# EAGLE design One Square Boy (EAGLE 8.6.1)
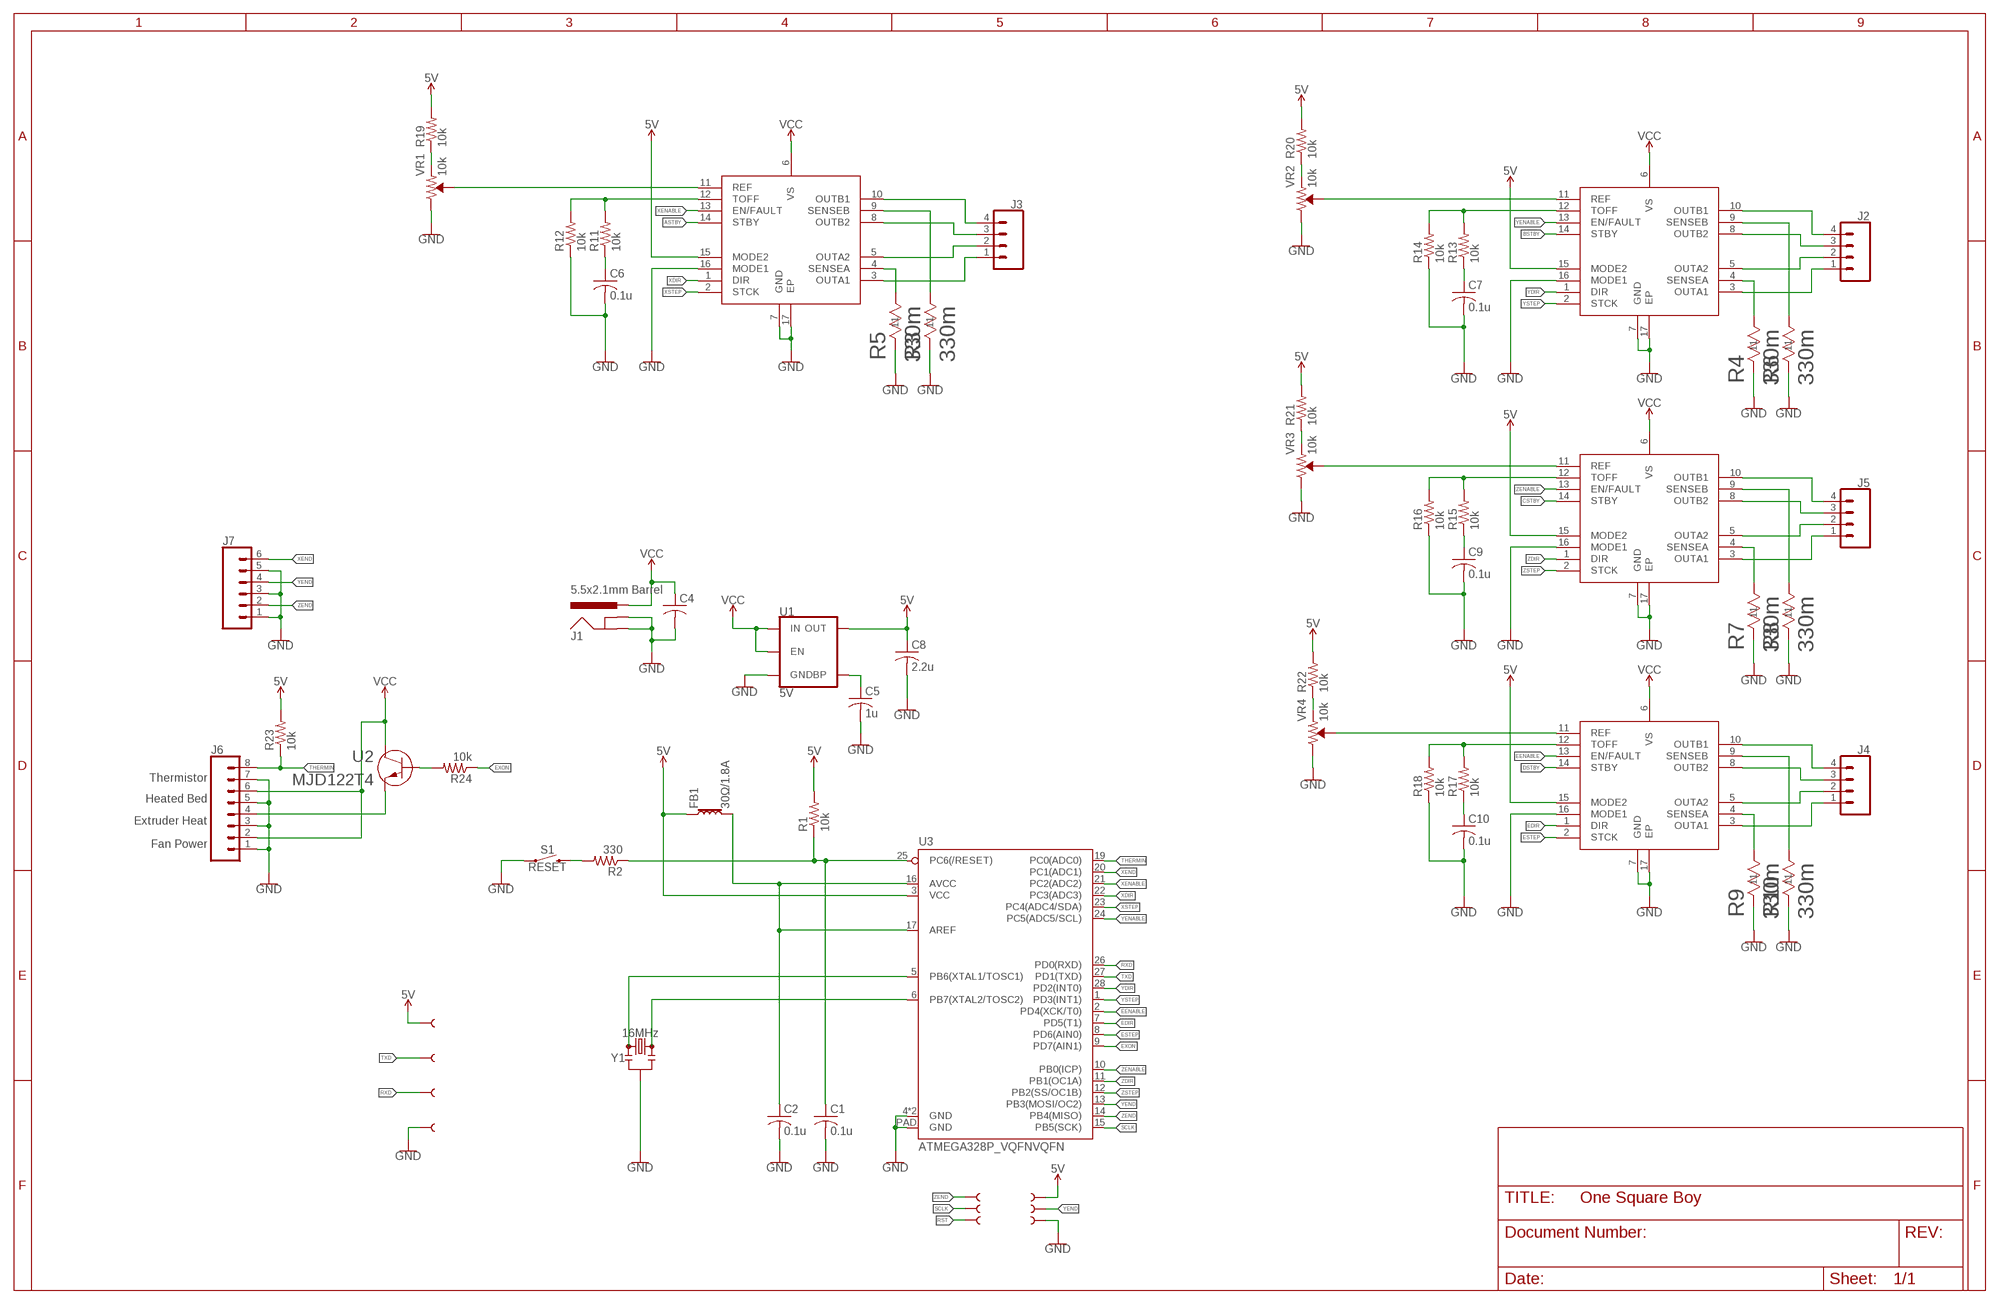
[diagram p0: schematic, sheet 1]

## Parts
C1  0.1u  C-USC0402  [C0402]
C2  0.1u  C-USC0402  [C0402]
C4  C-USC1206  [C1206]
C5  1u  C-USC0402  [C0402]
C6  0.1u  C-USC0402  [C0402]
C7  0.1u  C-USC0402  [C0402]
C8  2.2u  C-USC0402  [C0402]
C9  0.1u  C-USC0402  [C0402]
C10  0.1u  C-USC0402  [C0402]
FB1  30Ω/1.8A  FERRITE_BEAD-0603  [0603]
J1  5.5x2.1mm Barrel  POWER_JACKSMD  [POWER_JACK_SMD]
J2  CONN_04SMD2  [1X04_1MM_RA]
J3  CONN_04SMD2  [1X04_1MM_RA]
J4  CONN_04SMD2  [1X04_1MM_RA]
J5  CONN_04SMD2  [1X04_1MM_RA]
J6  CONN_08BM08B-SRSS-TB  [BM08B-SRSS-TB]
J7  CONN_06SMD-1MM  [1X06-1MM]
R1  10k  R-US_R0402  [R0402]
R2  330  R-US_R0402  [R0402]
R3  330m  KRL2012E-M-R330-F-T5RES_2012-L  [RES_2012-L]
R4  330m  KRL2012E-M-R330-F-T5RES_2012-L  [RES_2012-L]
R5  330m  KRL2012E-M-R330-F-T5RES_2012-L  [RES_2012-L]
R6  330m  KRL2012E-M-R330-F-T5RES_2012-L  [RES_2012-L]
R7  330m  KRL2012E-M-R330-F-T5RES_2012-L  [RES_2012-L]
R8  330m  KRL2012E-M-R330-F-T5RES_2012-L  [RES_2012-L]
R9  330m  KRL2012E-M-R330-F-T5RES_2012-L  [RES_2012-L]
R10  330m  KRL2012E-M-R330-F-T5RES_2012-L  [RES_2012-L]
R11  10k  R-US_R0402  [R0402]
R12  10k  R-US_R0402  [R0402]
R13  10k  R-US_R0402  [R0402]
R14  10k  R-US_R0402  [R0402]
R15  10k  R-US_R0402  [R0402]
R16  10k  R-US_R0402  [R0402]
R17  10k  R-US_R0402  [R0402]
R18  10k  R-US_R0402  [R0402]
R19  10k  R-US_R0402  [R0402]
R20  10k  R-US_R0402  [R0402]
R21  10k  R-US_R0402  [R0402]
R22  10k  R-US_R0402  [R0402]
R23  10k  R-US_R0402  [R0402]
R24  10k  R-US_R0402  [R0402]
S1  RESET  MOMENTARY-SWITCH-SPST-SMD-4.6X2.8MM  [TACTILE_SWITCH_SMD_4.6X2.8MM]
TP1  TEST-POINT3X5  [PAD.03X.05]
TP2  TEST-POINT3X5  [PAD.03X.05]
TP3  TEST-POINT3X5  [PAD.03X.05]
TP4  TEST-POINT3X5  [PAD.03X.05]
TP5  TEST-POINT3X5  [PAD.03X.05]
TP6  TEST-POINT3X5  [PAD.03X.05]
TP7  TEST-POINT3X5  [PAD.03X.05]
TP8  TEST-POINT3X5  [PAD.03X.05]
TP9  TEST-POINT3X5  [PAD.03X.05]
TP10  TEST-POINT3X5  [PAD.03X.05]
U1  5V  V_REG_MIC52055V  [SOT23-5]
U2  MJD122T4  [DPAK]
U3  ATMEGA328P_VQFNVQFN  [VQFN-28]
U$1  STSPIN220  [QFN50P300X300X100-17N]
U$2  STSPIN220  [QFN50P300X300X100-17N]
U$3  STSPIN220  [QFN50P300X300X100-17N]
U$4  STSPIN220  [QFN50P300X300X100-17N]
VR1  10k  TRIMPOT-SMD-3MM-OPEN-1/10W-25%  [TRIMPOT-SMD-TC33X]
VR2  10k  TRIMPOT-SMD-3MM-OPEN-1/10W-25%  [TRIMPOT-SMD-TC33X]
VR3  10k  TRIMPOT-SMD-3MM-OPEN-1/10W-25%  [TRIMPOT-SMD-TC33X]
VR4  10k  TRIMPOT-SMD-3MM-OPEN-1/10W-25%  [TRIMPOT-SMD-TC33X]
Y1  16MHz  RESONATOR-16MHZSMD_3.2X1.3  [RESONATOR-SMD-3.2X1.3]

## Nets
5V: C8.1 FB1.1 R1.2 R19.2 R20.2 R21.2 R22.2 R23.2 TP4.P$1 TP10.P$1 U1.5(OUT) U3.3(VCC) U$1.15(MODE2) U$2.15(MODE2) U$3.15(MODE2) U$4.15(MODE2)
ASTBY: U$1.14(STBY)
AVCC: C2.1 FB1.2 U3.16(AVCC) U3.17(AREF)
BSTBY: U$2.14(STBY)
CSTBY: U$3.14(STBY)
DSTBY: U$4.14(STBY)
EDIR: U3.7(PD5(T1)) U$4.1(DIR)
EENABLE: U3.2(PD4(XCK/T0)) U$4.13(EN/FAULT)
ESTEP: U3.8(PD6(AIN0)) U$4.2(STCK)
EXON: R24.1 U3.9(PD7(AIN1))
GND: C1.2 C2.2 C4.2 C5.2 C6.2 C7.2 C8.2 C9.2 C10.2 J1.GND(GNDBREAK) J1.P$4(GND) J6.1 J6.3 J6.5 J6.7 J7.1 J7.3 J7.5 R3.1 R4.1 R5.1 R6.1 R7.1 R8.1 R9.1 R10.1 R12.1 R14.1 R16.1 R18.1 S1.1 S1.2 TP6.P$1 TP7.P$1 U1.2(GND) U3.4(GND) U3.18(GND) U3.PAD(GND) U$1.7(GND) U$1.16(MODE1) U$1.17(EP) U$2.7(GND) U$2.16(MODE1) U$2.17(EP) U$3.7(GND) U$3.16(MODE1) U$3.17(EP) U$4.7(GND) U$4.16(MODE1) U$4.17(EP) VR1.1(CW) VR2.1(CW) VR3.1(CW) VR4.1(CW) Y1.2
N$1: R2.2 S1.3 S1.4
N$2: U3.5(PB6(XTAL1/TOSC1)) Y1.1
N$3: U3.6(PB7(XTAL2/TOSC2)) Y1.3
N$4: J4.4 U$4.10(OUTB1)
N$5: J4.3 U$4.8(OUTB2)
N$6: J4.2 U$4.5(OUTA2)
N$7: J4.1 U$4.3(OUTA1)
N$8: J5.2 U$3.5(OUTA2)
N$9: J5.1 U$3.3(OUTA1)
N$10: J5.4 U$3.10(OUTB1)
N$11: J5.3 U$3.8(OUTB2)
N$12: J2.4 U$2.10(OUTB1)
N$13: J2.3 U$2.8(OUTB2)
N$14: J2.2 U$2.5(OUTA2)
N$15: J2.1 U$2.3(OUTA1)
N$16: J3.4 U$1.10(OUTB1)
N$17: J3.3 U$1.8(OUTB2)
N$18: J3.1 U$1.3(OUTA1)
N$19: J3.2 U$1.5(OUTA2)
N$20: R9.2 U$4.4(SENSEA)
N$21: R10.2 U$4.9(SENSEB)
N$22: R7.2 U$3.4(SENSEA)
N$23: R8.2 U$3.9(SENSEB)
N$24: R4.2 U$2.4(SENSEA)
N$25: R6.2 U$2.9(SENSEB)
N$26: R5.2 U$1.4(SENSEA)
N$27: R3.2 U$1.9(SENSEB)
N$28: C5.1 U1.4(BP)
N$46: R11.2 R12.2 U$1.12(TOFF)
N$47: C6.1 R11.1
N$49: R13.2 R14.2 U$2.12(TOFF)
N$50: C7.1 R13.1
N$51: R24.2 U2.1(B1)
N$52: R15.2 R16.2 U$3.12(TOFF)
N$53: C9.1 R15.1
N$54: J6.4 U2.2(E2)
N$55: R17.2 R18.2 U$4.12(TOFF)
N$56: C10.1 R17.1
N$59: R20.1 VR2.3(CCW)
N$60: U$4.11(REF) VR4.2(WIPER)
N$61: U$3.11(REF) VR3.2(WIPER)
N$62: U$2.11(REF) VR2.2(WIPER)
N$63: U$1.11(REF) VR1.2(WIPER)
N$64: R19.1 VR1.3(CCW)
N$65: R21.1 VR3.3(CCW)
N$66: R22.1 VR4.3(CCW)
RST: C1.1 R1.1 R2.1 TP3.P$1 U3.25(PC6(/RESET))
RXD: TP8.P$1 U3.26(PD0(RXD))
SCLK: TP2.P$1 U3.15(PB5(SCK))
THERMIN: J6.8 R23.1 U3.19(PC0(ADC0))
TXD: TP9.P$1 U3.27(PD1(TXD))
VCC: C4.1 J1.VIN0(PWR) J6.2 J6.6 U1.1(IN) U1.3(EN) U2.3(C3) U$1.6(VS) U$2.6(VS) U$3.6(VS) U$4.6(VS)
XDIR: U3.22(PC3(ADC3)) U$1.1(DIR)
XENABLE: U3.21(PC2(ADC2)) U$1.13(EN/FAULT)
XEND: J7.6 U3.20(PC1(ADC1))
XSTEP: U3.23(PC4(ADC4/SDA)) U$1.2(STCK)
YDIR: U3.28(PD2(INT0)) U$2.1(DIR)
YENABLE: U3.24(PC5(ADC5/SCL)) U$2.13(EN/FAULT)
YEND: J7.4 TP5.P$1 U3.13(PB3(MOSI/OC2))
YSTEP: U3.1(PD3(INT1)) U$2.2(STCK)
ZDIR: U3.11(PB1(OC1A)) U$3.1(DIR)
ZENABLE: U3.10(PB0(ICP)) U$3.13(EN/FAULT)
ZEND: J7.2 TP1.P$1 U3.14(PB4(MISO))
ZSTEP: U3.12(PB2(SS/OC1B)) U$3.2(STCK)

## Notes on the sheet
- Thermistor
- Heated Bed
- Extruder Heat
- Fan Power

## Library data of the parts
C1 C2 C4-C10 = adafruit:C-US: CAPACITOR, American symbol
FB1 = SparkFun-Coils:FERRITE_BEAD: Ferrite Bead (blocks, cores, rings, chokes, etc.) Inductor with layers of ferrite used to suppress high frequencies. Often used to isolate high frequency noise. SparkFun Products: IOIO-OTG - V2.2 <https://www.sparkfun.com/products/13613> SparkFun SAMD21 Mini Breakout <https://www.sparkfun.com/products/13664> SparkFun 6 Degrees of Freedom Breakout - LSM6DS3 <https://www.sparkfun.com/products/13339> SparkFun SAMD21 Dev Breakout <https://www.sparkfun.com/products/13672>; PROD_ID: NDUC-13805
J1 = SparkFun-Connectors:POWER_JACK: Power Jack Connector This is the standard 5.5mm barrel jack for power. The PTH is the most common, proven, reliable, footprint. The Slot footprint only works if the mill layer is transmitted to the PCB fab house so be warned. Here are the connectors we sell at SparkFun: DC Barrel Power Jack/Connector <https://www.sparkfun.com/products/119> (PRT-00119) DC Barrel Power Jack/Connector (SMD) <https://www.sparkfun.com/products/12748> (PRT-12748) DC Barrel Jack Adapter - Breadboard Compatible <https://www.sparkfun.com/products/10811> (PRT-10811) It is used on this SparkFun product (and many, many others): SparkFun RedBoard - Programmed with Arduino <https://www.sparkfun.com/products/12757> (DEV-12757) Also, if you need a mating power supply or connector, please check these out: Wall Adapter Power Supply - 9VDC 650mA <https://www.sparkfun.com/products/298> (TOL-00298) DC Barrel Jack Adapter - Male <https://www.sparkfun.com/products/10287> (PRT-10287); PROD_ID: CONN-08106; SF_ID: PRT-12748
J2-J5 = SparkFun-Connectors:CONN_04: Multi connection point. Often used as Generic Header-pin footprint for 0.1 inch spaced/style header connections On any of the 0.1 inch spaced packages, you can populate with these: Break Away Headers - Straight <https://www.sparkfun.com/products/116> (PRT-00116) Break Away Male Headers - Right Angle <https://www.sparkfun.com/products/553> (PRT-00553) Female Headers <https://www.sparkfun.com/products/115> (PRT-00115) Break Away Headers - Machine Pin <https://www.sparkfun.com/products/117> (PRT-00117) Break Away Female Headers - Swiss Machine Pin <https://www.sparkfun.com/products/743> (PRT-00743) For SCREWTERMINALS and SPRING TERMINALS visit here: Screw Terimnals on SparkFun.com <https://www.sparkfun.com/search/results?term=Screw+Terminals> (5mm/3.5mm/2.54mm spacing) This device is also useful as a general connection point to wire up your design to another part of your project. Our various solder wires solder well into these plated through hole pads. Hook-Up Wire - Assortment (Stranded, 22 AWG) <https://www.sparkfun.com/products/11375> (PRT-11375) Hook-Up Wire - Assortment (Solid Core, 22 AWG) <https://www.sparkfun.com/products/11367> (PRT-11367) View the entire wire category on our website here <https://www.sparkfun.com/categories/141> Special notes: Molex polarized connector foot print use with SKU : PRT-08231 with associated crimp pins and housings. 1MM SMD Version SKU: PRT-10208; PROD_ID: CONN-10310; SF_ID: PRT-10208
J6 = SparkFun-Connectors:CONN_08: Multi connection point. Often used as Generic Header-pin footprint for 0.1 inch spaced/style header connections On any of the 0.1 inch spaced packages, you can populate with these: Break Away Headers - Straight <https://www.sparkfun.com/products/116> (PRT-00116) Break Away Male Headers - Right Angle <https://www.sparkfun.com/products/553> (PRT-00553) Female Headers <https://www.sparkfun.com/products/115> (PRT-00115) Break Away Headers - Machine Pin <https://www.sparkfun.com/products/117> (PRT-00117) Break Away Female Headers - Swiss Machine Pin <https://www.sparkfun.com/products/743> (PRT-00743) Arduino Stackable Header - 8 Pin <https://www.sparkfun.com/products/9279> (PRT-09279) For SCREWTERMINALS and SPRING TERMINALS visit here: Screw Terimnals on SparkFun.com <https://www.sparkfun.com/search/results?term=Screw+Terminals> (5mm/3.5mm/2.54mm spacing) This device is also useful as a general connection point to wire up your design to another part of your project. Our various solder wires solder well into these plated through hole pads. Hook-Up Wire - Assortment (Stranded, 22 AWG) <https://www.sparkfun.com/products/11375> (PRT-11375) Hook-Up Wire - Assortment (Solid Core, 22 AWG) <https://www.sparkfun.com/products/11367> (PRT-11367) View the entire wire category on our website here <https://www.sparkfun.com/categories/141> Special notes: Molex polarized connector foot print use with SKU : PRT-08231 with associated crimp pins and housings. 1MM SMD Version SKU: PRT-10208 NOTES ON THE VARIANTS LOCK and LOCK_LONGPADS... This footprint was designed to help hold the alignment of a through-hole component (i.e. 6-pin header) while soldering it into place. You may notice that each hole has been shifted either up or down by 0.005 of an inch from it's more standard position (which is a perfectly straight line). This slight alteration caused the pins (the squares in the middle) to touch the edges of the holes. Because they are alternating, it causes a "brace" to hold the component in place. 0.005 has proven to be the perfect amount of "off-center" position when using our standard breakaway headers. Although looks a little odd when you look at the bare footprint, once you have a header in there, the alteration is very hard to notice. Also,if you push a header all the way into place, it is covered up entirely on the bottom side.; PROD_ID: CONN-10556
J7 = SparkFun-Connectors:CONN_06: Multi connection point. Often used as Generic Header-pin footprint for 0.1 inch spaced/style header connections On any of the 0.1 inch spaced packages, you can populate with these: Break Away Headers - Straight <https://www.sparkfun.com/products/116> (PRT-00116) Break Away Male Headers - Right Angle <https://www.sparkfun.com/products/553> (PRT-00553) Female Headers <https://www.sparkfun.com/products/115> (PRT-00115) Break Away Headers - Machine Pin <https://www.sparkfun.com/products/117> (PRT-00117) Break Away Female Headers - Swiss Machine Pin <https://www.sparkfun.com/products/743> (PRT-00743) Arduino Stackable Header - 6 Pin <https://www.sparkfun.com/products/9280> (PRT-09280) For SCREWTERMINALS and SPRING TERMINALS visit here: Screw Terimnals on SparkFun.com <https://www.sparkfun.com/search/results?term=Screw+Terminals> (5mm/3.5mm/2.54mm spacing) This device is also useful as a general connection point to wire up your design to another part of your project. Our various solder wires solder well into these plated through hole pads. Hook-Up Wire - Assortment (Stranded, 22 AWG) <https://www.sparkfun.com/products/11375> (PRT-11375) Hook-Up Wire - Assortment (Solid Core, 22 AWG) <https://www.sparkfun.com/products/11367> (PRT-11367) View the entire wire category on our website here <https://www.sparkfun.com/categories/141>; PROD_ID: CONN-08249; SF_ID: GPS-00579
R1 R2 R11-R24 = adafruit:R-US_: RESISTOR, American symbol
R3-R10 = Susumu KRL2012E-M-R330-F-T5:KRL2012E-M-R330-F-T5; MANUFACTURER_PART_NUMBER: KRL2012EMR330FT5; VENDOR: Susumu
S1 = SparkFun-Switches:MOMENTARY-SWITCH-SPST: Momentary Switch (Pushbutton) - SPST Normally-open (NO) SPST momentary switches (buttons, pushbuttons). Variants PTH-12MM - 12mm square, through-hole Momentary Pushbutton Switch - 12mm Square <https://www.sparkfun.com/products/9190> (COM-09190) PTH-6.0MM, PTH-6.0MM-KIT - 6.0mm square, through-hole Mini Pushbutton Switch <https://www.sparkfun.com/products/97> (COM-00097) KIT package intended for soldering kit's - only one side of pads' copper is exposed. PTH-RIGHT-ANGLE-KIT - Right-angle, through-hole Right Angle Tactile Button <https://www.sparkfun.com/products/10791> - Used on SparkFun BigTime Watch Kit <https://www.sparkfun.com/products/11734> SMD-12MM - 12mm square, surface-mount Tactile Button - SMD (12mm) <https://www.sparkfun.com/products/12993> (COM-12993) Used on SparkFun PicoBoard <https://www.sparkfun.com/products/11888> SMD-4.5MM - 4.5mm Square Trackball Switch Used on SparkFun Blackberry Trackballer Breakout <https://www.sparkfun.com/products/13169> SMD-4.6MMX2.8MM - 4.60mm x 2.80mm, surface mount Used on SparkFun SAMD21 Mini Breakout <https://www.sparkfun.com/products/13664> SMD-5.2MM, SMD-5.2-REDUNDANT - 5.2mm square, surface-mount Mini Pushbutton Switch - SMD <https://www.sparkfun.com/products/8720> (COM-08720) Used on Arduino Pro Mini <https://www.sparkfun.com/products/11114> REDUNDANT package connects both switch circuits together SMD-6.0X3.5MM - 6.0 x 3.5mm, surface mount Momentary Reset Switch SMD <https://www.sparkfun.com/products/8229> (COM-08229) SMD-6.2MM-TALL - 6.2mm square, surface mount Tactile Button - SMD (6mm) <https://www.sparkfun.com/products/12992> Used on SparkFun Digital Sandbox <https://www.sparkfun.com/products/12651> SMD-RIGHT-ANGLE - Right-angle, surface mount Used on SparkFun Block for Intel® Edison - Arduino <https://www.sparkfun.com/products/13036>; PROD_ID: SWCH-13065
TP1-TP10 = SparkFun-Connectors:TEST-POINT: SparkFun Test Points Bare copper test points for troubleshooting or In-Circuit-Testing. These are used by our Production team for verifying production board runs using pogo-pins on test beds. SparkFun Products: SparkFun LSM9DS1 Breakout <https://www.sparkfun.com/products/13284> SparkFun PSOC <https://www.sparkfun.com/products/13714> SparkFun Load Cell Amplifier <https://www.sparkfun.com/products/13879>
U1 = SparkFun-IC-Power:V_REG_MIC5205: V_REG MIC5205 Standard 3.3V, 5V, and Adjustable 150mA LDO voltage regulator in SOT-23 layout. Micrel part MIC5205. BP (by-pass) pin is used to lower output noise with 470pF cap, may be left open. On the adjustable version BP is used to set output.; PROD_ID: VREG-00823
U2 = MJD122:MJD122T4; MANUFACTURER_PART_NUMBER: MJD122T4; VENDOR: STMicroelectronics
U3 = SparkFun-IC-Microcontroller:ATMEGA328P_VQFN: Atmel 328P QFN part not in catalog
U$1-U$4 = QFN50P300X300X100-17N:STSPIN220
VR1-VR4 = SparkFun-Resistors:TRIMPOT: Trimming Potentiometer (Trimpot) Three-terminal potentiometers, with an adjustable wiper and two adjustable resistors. A pot can be used to create a configurable voltage divider, or as a variable resistor. "Trimpots" are a subset of potentiometers, usually intended for "set-and-forget" applications. They're often more delicate than standard potentiometers - rated for fewer turns. Variants PTH-KNOB - PTH Trimpot w/ finger-adjustable knob Trimpot 10K with Knob <https://www.sparkfun.com/products/9806> (COM-09806) Datasheet <http://www.sparkfun.com/datasheets/Components/General/TSR-3386.pdf> SMD-3MM-CLOSED-FRAME - SMD 3mm Square Closed-Frame Trimpot Used on e.g. EasyDriver - Stepper Motor Driver <https://www.sparkfun.com/products/12779> Datasheet <http://www.bitechnologies.com/pdfs/22.pdf> (22AR10KTR) SMD-5MM - SMD 5mm Square Closed-Frame Trimpot Used on e.g. IOIO-OTG - V2.2 <https://www.sparkfun.com/products/13613> Datasheet <http://www.vishay.com/docs/51008/ts53.pdf> (TS53YL502MR10) SMD-3MM-1/10W-25% - 3mm Square Open-Frame Trimpot Used on e.g. SparkFun Shapeoko <https://www.sparkfun.com/products/13899> Datasheet <http://www.bourns.com/docs/Product-Datasheets/TC33.pdf> (TC33X-2-103E); PROD_ID: RES-12428, RES-08048
Y1 = SparkFun-Clocks:RESONATOR-16MHZ: 16MHz Resonator Digikey Example <http://www.digikey.com/product-detail/en/murata-electronics-north-america/CSTCE16M0V53-R0/490-1198-1-ND/584635> Frequency: 16MHz Frequency Stability: ±0.3% Frequency Tolerance: ±0.5% Capacitance: 15pF SparkFun Products SparkFun OpenLog <https://www.sparkfun.com/products/13712> SparkFun MicroView - OLED Arduino Module <https://www.sparkfun.com/products/12923>; PROD_ID: XTAL-08900

## Board
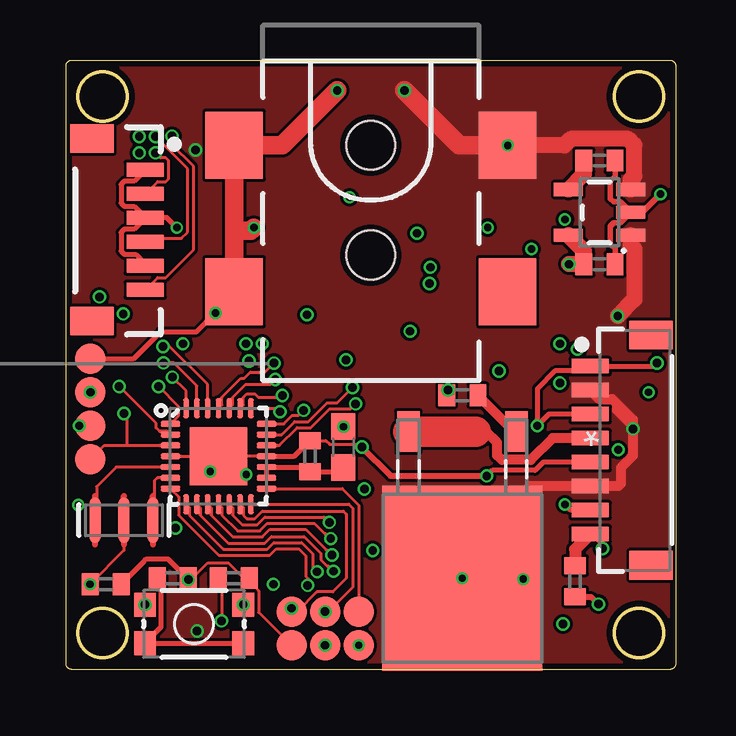
[diagram p1: board, top side]
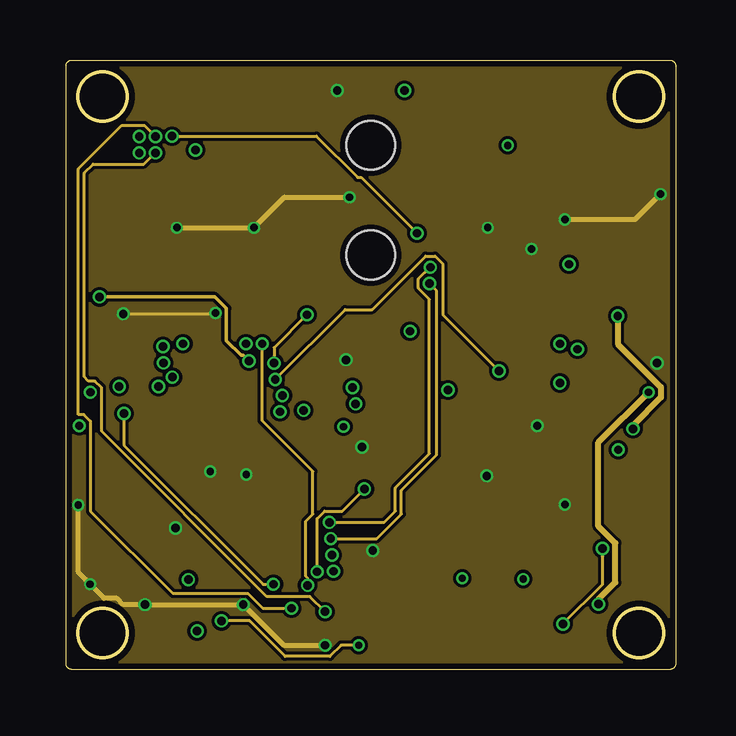
[diagram p2: board, inner layer GND]
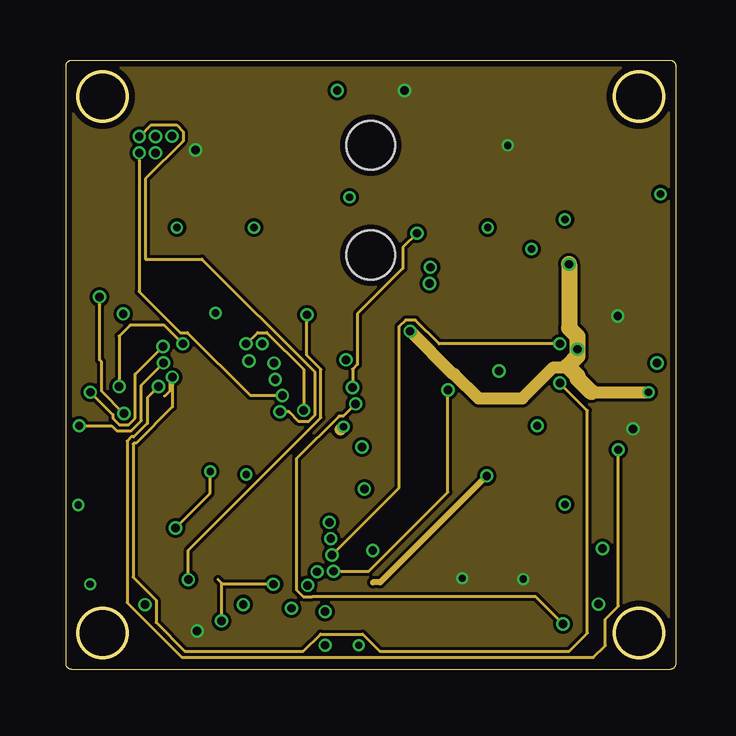
[diagram p3: board, inner layer VCC]
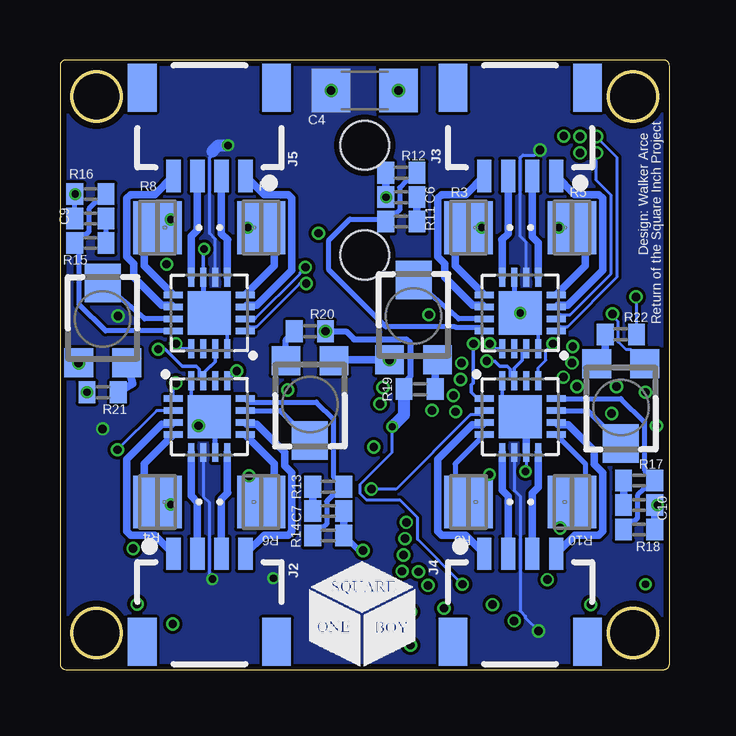
[diagram p4: board, bottom side, seen from below]

Size 25.4 x 25.4 mm. Coordinates in mm from the lower left corner, seen from the top.
Outline: 25.15,0 0.25,0 arc-90 0,0.25 0,25.15 arc-90 0.25,25.4 25.15,25.4 arc-90 25.4,25.15 25.4,0.25 arc-90 25.15,0
Outline: circle at 1.52,23.88 radius 1.02
Outline: circle at 23.88,23.88 radius 1.02
Outline: circle at 1.52,1.52 radius 1.02
Outline: circle at 23.88,1.52 radius 1.02
Copper layers (1*2*15*16): Signal1 0.035559375mm / dielectric 0.17018125mm / GND 0.01778125mm / dielectric 47mil / VCC 0.01778125mm / dielectric 0.17018125mm / Signal2 0.035559375mm
Design rules "oshpark-4layer *": minimum track width 5mil, minimum drill 10mil, track to track 5mil, track to pad 5mil, pad to pad 5mil, via to via 5mil, smd to smd 5mil, copper to edge 10mil, drill to drill 6mil, minimum pad ring 4mil, minimum via ring 4mil, stop-mask expansion 2.5mil, vias tented up to drill 0mil, thermal gap 10mil

### Footprints (pad centres in the part's own frame; a part is rotated, then mirrored left to right if it is on the bottom)
C0402 = smd 0.7 x 0.9: 1 -0.65,0; 2 0.65,0
C1206 = smd 1.6 x 1.8: 1 -1.4,0; 2 1.4,0
0603 = smd 1.1 x 1: 1 -0.85,0; 2 0.85,0
POWER_JACK_SMD = smd 2.8 x 2.4: GND 0,-5.7; P$4 6.1,-5.7; VIN0 0,5.7; VIN1 6.1,5.7 | hole 2.032: 0,0; 4.572,0
1X04_1MM_RA = smd 0.6 x 1.35: 1 -1.5,0; 2 -0.5,0; 3 0.5,0; 4 1.5,0 | smd 1.2 x 2: NC1 2.8,-3.675; NC2 -2.8,-3.675
BM08B-SRSS-TB = smd 0.6 x 1.55: 1 -3.5,0; 2 -2.5,0; 3 -1.5,0; 4 -0.5,0; 5 0.5,0; 6 1.5,0; 7 2.5,0; 8 3.5,0 | smd 1.2 x 1.8: P$9 4.8,2.525; P$10 -4.8,2.525
1X06-1MM = smd 0.6 x 1.55: 1 -2.54,1.27; 2 -1.54,1.27; 3 -0.54,1.27; 4 0.46,1.27; 5 1.46,1.27; 6 2.46,1.27 | smd 1.2 x 1.8: P$1 -3.84,-0.955; P$2 3.76,-0.955
R0402 = smd 0.7 x 0.9: 1 -0.65,0; 2 0.65,0
RES_2012-L = smd 0.902 x 2.2: 1 -0.553,0; 2 0.553,0
TACTILE_SWITCH_SMD_4.6X2.8MM = smd 0.9 x 1: 1 -2.05,-0.8; 2 2.05,-0.8; 3 2.05,0.8; 4 -2.05,0.8
PAD.03X.05 = smd 1.27 x 1.27: P$1 0,0
SOT23-5 = smd 0.55 x 1.2: 1 -0.95,-1.3; 2 0,-1.3; 3 0.95,-1.3; 4 0.95,1.3; 5 -0.95,1.3
DPAK = smd 0.94 x 1.702: 1 -2.25,-6.109; 2 2.25,-6.109 | smd 6.655 x 7.722: 3 0,0
VQFN-28 = smd 0.82 x 0.24: 1 -2,1.35; 2 -2,0.9; 3 -2,0.45; 4 -2,0; 5 -2,-0.45; 6 -2,-0.9; 7 -2,-1.35; 15 2,-1.35; 16 2,-0.9; 17 2,-0.45; 18 2,0; 19 2,0.45; 20 2,0.9; 21 2,1.35 | smd 0.24 x 0.82: 8 -1.35,-2; 9 -0.9,-2; 10 -0.45,-2; 11 0,-2; 12 0.45,-2; 13 0.9,-2; 14 1.35,-2; 22 1.35,2; 23 0.9,2; 24 0.45,2; 25 0,2; 26 -0.45,2; 27 -0.9,2; 28 -1.35,2 | smd 2.4 x 2.4: PAD 0,0
QFN50P300X300X100-17N = smd 0.79 x 0.26: 1 -1.495,0.75; 2 -1.495,0.25; 3 -1.495,-0.25; 4 -1.495,-0.75; 9 1.495,-0.75; 10 1.495,-0.25; 11 1.495,0.25; 12 1.495,0.75 | smd 0.26 x 0.79: 5 -0.75,-1.495; 6 -0.25,-1.495; 7 0.25,-1.495; 8 0.75,-1.495; 13 0.75,1.495; 14 0.25,1.495; 15 -0.25,1.495; 16 -0.75,1.495 | smd 1.8 x 1.8: 17 0,0
TRIMPOT-SMD-TC33X = smd 1.2 x 1.2: 1 -1,-1.825; 3 1,-1.825 | smd 1.5 x 1.6: 2 0,1.5
RESONATOR-SMD-3.2X1.3 = smd 0.45 x 1.905: 1 -1.2,0; 2 0,0; 3 1.2,0

### Placement (x,y rotation side)
C1  1.65,3.56 180 top
C2  10.16,8.89 90 top
C4  12.7,24.13 0 bottom
C5  22.23,21.21 0 top
C6  11.18,19.69 180 bottom
C7  14.22,6.6 0 bottom
C8  22.23,16.89 0 top
C9  24.13,18.8 180 bottom
C10  1.27,6.86 0 bottom
FB1  11.56,9.27 270 top
J1  12.7,21.84 270 top
J2  19.18,4.83 0 bottom
J3  6.22,20.57 180 bottom
J4  6.22,4.83 0 bottom
J5  19.18,20.57 180 bottom
J6  21.84,9.14 270 top
J7  2.03,18.29 270 top
R1  6.98,3.81 180 top
R2  4.45,3.81 180 top
R3  8.38,18.41 180 bottom
R4  21.34,6.98 180 bottom
R5  4.06,18.41 0 bottom
R6  17.02,6.98 0 bottom
R7  17.02,18.41 0 bottom
R8  21.34,18.41 180 bottom
R9  8.38,6.98 180 bottom
R10  4.06,6.98 0 bottom
R11  11.18,18.67 180 bottom
R12  11.18,20.7 0 bottom
R13  14.22,7.62 0 bottom
R14  14.22,5.59 180 bottom
R15  24.13,17.78 180 bottom
R16  24.13,19.81 0 bottom
R17  1.27,7.87 0 bottom
R18  1.27,5.84 180 bottom
R19  10.41,11.68 180 bottom
R20  14.99,14.1 0 bottom
R21  23.62,11.56 180 bottom
R22  2.03,13.97 0 bottom
R23  21.21,3.68 270 top
R24  16.51,11.43 0 top
S1  5.33,1.91 180 top
TP1  10.8,2.41 0 top
TP2  12.19,2.41 0 top
TP3  9.4,1.02 0 top
TP4  12.19,1.02 0 top
TP5  9.4,2.41 0 top
TP6  10.8,1.02 0 top
TP7  1.02,12.95 0 top
TP8  1.02,11.56 0 top
TP9  1.02,10.16 0 top
TP10  1.02,8.76 0 top
U1  22.23,19.05 90 top
U2  16.51,3.81 180 top
U3  6.35,8.89 0 top
U$1  6.22,14.86 180 bottom
U$2  19.18,10.54 0 bottom
U$3  19.18,14.86 180 bottom
U$4  6.22,10.54 0 bottom
VR1  10.67,14.73 0 bottom
VR2  14.99,11.05 180 bottom
VR3  23.62,14.61 0 bottom
VR4  2.03,10.92 180 bottom
Y1  2.41,6.22 0 top

### Tracks (layer width: path | path; a pad name or v marks a point on that pad's centre or on a via)
5V  (via drill 0.3, 0.35)
  Signal1 0.127: TP10.P$1 1.59,9.34 2.54,9.34 | 2.54,9.34 U3.3 | 2.54,9.34 2.54,10.54 v2.41,10.67 | 6.34,3.75 R1.2 6.48,3.67 v6.48,2.03
  Signal1 0.254: R23.2 21.88,3.03 v22.18,2.73
  Signal1 0.66: U1.5 21.58,17.45 C8.1 v20.95,16.89
  GND 0.127: v6.48,2.03 7.64,2.03 9.13,0.55 10.99,0.55 11.46,1.02 TP4.P$1 | v2.41,10.67 2.41,9.35 8.21,3.56 v8.64,3.56
  GND 0.152: v7.62,12.86 7.38,13.1 7.29,13.1 6.68,13.71 6.68,15.05 6.2,15.53 v1.4,15.53
  GND 0.254: v22.18,2.73 22.18,2.94 22.88,3.64 22.88,5.27 22.18,5.97 22.18,9.47 R21.2
  VCC 0.127: v1.4,15.53 1.4,12.9 1.48,12.82 1.48,11.61 v2.41,10.67 | v6.48,2.03 6.48,3.61 | 6.48,3.61 6.34,3.75 | v8.64,3.56 6.53,3.56 6.48,3.61
  VCC 0.508: 11.43,9.99 FB1.1 | R20.2 16.12,12.31 16.18,12.31 17.19,11.3 19.01,11.3 20.3,12.6 20.85,12.6 21.88,11.56 R21.2
  VCC 0.66: v20.95,16.89 20.95,14.23 21.31,13.88 v21.31,13.35 21.31,13.06 20.9,12.65 21.31,12.24 21.31,12.13 21.88,11.56
  Signal2 0.127: v1.4,15.53 1.4,13.98 R22.2 | v8.64,3.56 10.5,5.42 10.5,6.33 11.23,7.06 12.62,7.06 12.89,7.33 12.89,7.72 11.56,9.05 FB1.1
  Signal2 0.152: U$3.15 18.93,12.83 18.92,12.83 19.12,12.63 19.14,12.63 19.43,12.35 U$2.15 19.59,12.2 19.59,12.52 19.71,12.63 20.31,12.63 21.02,13.35 v21.31,13.35 | U$1.15 6.14,13.2 6.14,12.88 6.47,12.55 U$4.15 6.64,12.2 6.64,12.52 6.76,12.63 7.07,12.63 7.29,12.86 v7.62,12.86
  Signal2 0.254: R20.2 13.48,14.1 13.14,13.76 10.96,13.76 10.81,13.61 10.81,12.2 11.06,11.95 R19.2
  Signal2 0.508: FB1.1 11.06,10.61 R19.2
  other vias: 24.27,11.56 12.19,1.02 11.56,10.12 14.34,14.1
AVCC
  Signal1 0.203: U3.16 U3.17 9.96,8.44 C2.1 11.38,8.24 FB1.2
EDIR  (via drill 0.35)
  Signal1 0.127: U3.7 4.69,7.2 4.69,6.44 6.36,4.77 8.5,4.77 8.76,5.04 9.7,5.04 10,4.74 10,3.88 10.07,3.81 v10.07,3.51
  GND 0.127: v10.07,3.51 10.07,3.81 10,3.88 10,6.18 10.29,6.47 10.29,8.26 8.17,10.37 v8.17,13.58
  Signal2 0.152: U$4.1 7.99,11.29 8.26,11.56 8.26,11.87 8.19,11.94 8.19,13.56 v8.17,13.58
EENABLE  (via drill 0.35)
  Signal1 0.127: U3.2 4.21,9.93 3.9,9.93 3.75,10.08 3.75,10.26 v2.21,11.8
  VCC 0.127: v4.87,13.58 4.65,13.79 4.09,14.35 2.67,14.35 2.21,13.9 v2.21,11.8
  Signal2 0.127: v4.87,13.58 5.15,13.29 5.15,12.89 5.47,12.57 U$4.13
ESTEP  (via drill 0.35)
  Signal1 0.127: U3.8 5.14,6.75 5.14,6.44 6.56,5.02 8.39,5.02 8.66,5.29 9.82,5.29 10.28,4.82 10.28,4.26 v10.46,4.08
  GND 0.127: v12.43,7.52 11.51,6.6 10.78,6.6 10.46,6.29 v10.46,4.08
  Signal2 0.127: U$4.2 7.9,10.61 8.3,10.61 11.39,7.52 v12.43,7.52
EXON  (via drill 0.35)
  Signal1 0.127: U3.9 5.59,6.75 5.59,6.44 6.75,5.27 8.29,5.27 8.55,5.54 9.92,5.54 10.62,4.85 10.62,4.58 10.89,4.31 10.93,4.31 v11.14,4.1 | v15.91,11.66 15.91,11.48 R24.1
  VCC 0.127: v11.14,4.1 12.61,4.1 15.91,7.4 v15.91,11.66
GND  (via drill 0.3, 0.35)
  Signal1 0.127: Y1.2 2.41,4.97 C1.2 | U3.4 U3.PAD U3.18 | C2.2 10.82,9.54 10.98,9.38 12.22,9.38 v12.33,9.27 | TP7.P$1 1.27,12.95
  Signal1 0.152: U3.PAD 7.11,8.13 v7.51,8.13
  Signal1 0.203: J7.1 2.83,20.36 2.43,20.36 2.3,20.22 2.3,19.43 2.43,19.3 2.83,19.3 J7.3 | J7.3 2.83,18.36 2.43,18.36 2.3,18.22 2.3,17.43 2.43,17.3 2.89,17.3 3.3,16.89 J7.5 | R5.1 4.2,18.83 J7.3 | U3.18 9.51,8.89 C2.2 | J6.3 20.12,10.64 v19.63,10.16 19.63,11.71 20.37,12.44 21.64,12.44 J6.1 24.49,12.64 VR3.1 | J6.5 19.88,8.64 19.55,8.31 17.76,8.31 v17.53,8.07 | J6.7 21.02,6.64 v20.78,6.88 | U$1.17 5.45,14.08 3.94,14.08 2.81,12.95 1.27,12.95
  Signal1 0.229: U1.2 23.09,19.48 22.83,19.48 22.68,19.62 22.68,20.38 22.88,20.57 C5.2 | v24.77,19.81 24,19.05 U1.2 | U1.2 23.09,18.62 22.83,18.62 22.68,18.48 22.68,17.73 22.88,17.53 C8.2
  Signal1 0.254: v12.33,9.27 13.52,8.07 v17.53,8.07
  Signal1 0.762: C4.2 9.01,21.84 J1.GND 7,18.29 | J1.P$4 7,18.29 | R3.1 7.7,18.29 7,18.29
  GND 0.127: v2.38,14.82 6.19,14.82 U$1.17
  GND 0.203: v11.81,19.69 9.1,19.69 R3.1 R5.1 | v20.78,18.76 23.71,18.76 v24.77,19.81 | TP6.P$1 9.07,1.02 S1.1 S1.2 2.39,2.71 2.12,2.97 1.59,2.97 C1.2 0.51,4.05 v0.51,6.86
  VCC 0.127: v4.56,5.91 6.01,7.35 v6.01,8.26
  VCC 0.254: v17.53,8.07 13.08,3.63 12.78,3.63
  Signal2 0.127: U$4.7 5.97,8.29 v6.01,8.26 | C10.2 v0.51,6.86 | U$2.17 19.56,10.16 19.58,10.16 v19.63,10.16 | R6.1 17.57,8.03 v17.53,8.07 | R10.1 4.62,5.96 v4.56,5.91 | VR4.1 1.62,13.33 1.81,13.33 2.14,13.66 2.14,14.5 2.38,14.74 v2.38,14.82 | C6.2 v11.81,19.69 | 12.86,4.87 v12.78,4.95 v12.78,4.96
  Signal2 0.152: U$3.7 19.43,17.49 v19.39,17.52 | U$1.16 5.47,14.11 U$1.17 | U$4.16 6.97,11.29 6.19,10.5 | U$3.16 18.43,14.11 19.24,14.92 | U$2.16 19.93,10.5 19.58,10.16
  Signal2 0.203: C9.2 R16.1 v24.77,19.81 | R8.1 v20.78,18.76 | R9.1 7.83,7.81 v7.51,8.13 | C6.2 11.83,19.94 | U$3.7 19.43,15.11 19.24,14.92 U$3.17 | U$1.7 6.47,15.11 U$1.17 | U$2.7 18.93,10.29 U$2.17 | R4.1 v20.78,6.88
  Signal2 0.254: 12.78,4.79 12.86,4.87 R14.1
  Signal2 0.305: U$4.7 5.97,10.29 6.19,10.5 U$4.17 | VR1.1 13.95,12.91 VR2.1 | C7.2 R14.1 | C10.2 R18.1 | 11.83,19.94 R12.1
  other vias: 17.57,18.41 7.83,18.41 4.62,18.41 6.22,14.86 1,3.56 10.8,1.02 3.28,2.71 7.38,2.71 11.3,24.13 11.67,12.91 24.62,12.78
  pour GND (no thermals): 25.4,25.53 25.4,0 -0.13,0 -0.13,25.53
N$1
  Signal1 0.203: R2.2 3.8,3.47 3.96,3.3 3.96,1.78 S1.3 S1.4
N$2
  Signal1 0.127: U3.5 2.09,8.44 1.27,7.62 1.27,6.28 Y1.1
N$3
  Signal1 0.127: U3.6 3.8,7.99 3.68,7.87 3.68,6.29 Y1.3
N$4
  Signal2 0.305: J4.4 3.94,5.61 2.94,5.61 2.78,5.77 2.78,8.2 3.13,8.55 3.13,9.11 4.22,10.2 4.64,10.2 U$4.10
N$5
  Signal2 0.305: J4.3 5.72,7.36 5.47,7.61 U$4.8
N$6
  Signal2 0.305: J4.2 6.72,7.23 6.97,7.48 U$4.5
N$7
  Signal2 0.305: U$4.3 7.81,10.2 8.23,10.2 9.67,8.76 9.67,5.77 9.5,5.61 8.5,5.61 J4.1
N$8
  Signal2 0.305: J5.2 18.68,18.17 18.41,17.91 18.43,17.9 U$3.5
N$9
  Signal2 0.305: U$3.3 17.61,15.18 17.19,15.18 15.73,16.64 15.73,19.63 15.9,19.79 16.9,19.79 J5.1
N$10
  Signal2 0.305: U$3.10 20.74,15.18 21.16,15.18 22.32,16.34 22.32,16.9 22.62,17.2 22.62,19.63 22.46,19.79 21.46,19.79 J5.4
N$11
  Signal2 0.305: J5.3 19.68,18.3 19.93,18.05 U$3.8
N$12
  Signal2 0.305: J2.4 16.9,5.61 15.9,5.61 15.73,5.77 15.73,8.2 16.03,8.5 16.03,9.06 17.19,10.22 17.61,10.22 U$2.10
N$13
  Signal2 0.305: J2.3 18.68,7.1 18.41,7.37 18.43,7.38 U$2.8
N$14
  Signal2 0.305: J2.2 19.68,6.98 19.94,7.24 19.94,9.03 U$2.5
N$15
  Signal2 0.305: U$2.3 20.74,10.22 21.16,10.22 22.62,8.76 22.62,5.77 22.46,5.61 21.46,5.61 J2.1
N$16
  Signal2 0.305: U$1.10 7.79,15.18 8.21,15.18 9.37,16.34 9.37,16.9 9.67,17.2 9.67,19.63 9.5,19.79 8.5,19.79 J3.4
N$17
  Signal2 0.305: J3.3 6.72,18.17 6.98,17.91 6.97,17.9 U$1.8
N$18
  Signal2 0.305: J3.1 3.94,19.79 2.94,19.79 2.78,19.63 2.78,16.64 4.24,15.18 4.66,15.18 U$1.3
N$19
  Signal2 0.305: J3.2 5.72,18.04 5.47,17.79 U$1.5
N$20
  Signal2 0.203: U$4.4 8.94,8.57 R9.2
N$21
  Signal2 0.203: U$4.9 3.51,8.57 R10.2
N$22
  Signal2 0.305: U$3.4 16.47,16.83 R7.2
N$23
  Signal2 0.305: U$3.9 21.89,16.83 R8.2
N$24
  Signal2 0.305: U$2.4 21.89,8.57 R4.2
N$25
  Signal2 0.305: U$2.9 16.47,8.57 R6.2
N$26
  Signal2 0.305: U$1.4 3.51,16.83 R5.2
N$27
  Signal2 0.305: U$1.9 8.94,16.83 R3.2
N$28
  Signal1 0.66: U1.4 21.58,20.65 C5.1
N$46
  Signal2 0.203: U$1.12 7.86,14.25 8.9,14.25 8.93,14.28 11.83,14.28 14.2,16.65 14.2,17.89 13.32,18.77 12.08,18.77 11.98,18.67 | 11.98,18.67 R11.2 | 11.98,18.67 11.64,19.01 11.38,19.01 11.25,19.14 11.25,20.09 10.97,20.36 10.86,20.36 R12.2
N$47
  Signal2 0.305: C6.1 R11.1
N$49
  Signal2 0.203: U$2.12 17.54,11.15 14.71,11.15 14.01,10.44 14.01,8.05 R13.2 13.91,7.28 14.02,7.28 14.3,7.01 14.3,6.06 14.43,5.93 14.54,5.93 R14.2
N$50
  Signal2 0.305: C7.1 R13.1
N$51
  Signal1 0.406: R24.2 18.67,9.92 U2.1
N$52
  Signal2 0.203: U$3.12 23.5,14.11 24.6,15.21 24.6,17.6 R15.2 24.44,18.12 24.34,18.12 24.2,18.25 24.2,19.2 23.93,19.48 23.82,19.48 R16.2
N$53
  Signal2 0.203: R15.1 C9.1
N$54
  Signal1 0.406: J6.4 20.27,9.64 19.37,8.74 18.15,8.74 17.96,8.93 17.96,9.47 17.51,9.92 17.07,9.92
  Signal1 1.27: U2.2 17.07,9.92
N$55
  Signal2 0.203: U$4.12 2.03,11.29 1.05,10.32 1.05,8.31 R17.2 0.96,7.54 1.07,7.54 1.34,7.26 1.34,6.31 1.48,6.18 1.58,6.18 R18.2
N$56
  Signal2 0.305: C10.1 R17.1
N$59
  Signal2 0.254: VR2.3 15.99,13.75 R20.1
N$60
  Signal2 0.203: U$4.11 3.4,10.79 VR4.2
N$61
  Signal2 0.203: U$3.11 21.87,14.61 VR3.2
N$62
  Signal2 0.203: U$2.11 16.23,10.79 VR2.2
N$63
  Signal2 0.203: U$1.11 8.79,14.61 VR1.2
N$64
  Signal2 0.305: R19.1 9.76,12.81 VR1.3
N$65
  Signal2 0.305: R21.1 22.37,11.91 VR3.3
N$66
  Signal2 0.305: VR4.3 2.68,13.1 R22.1
RST  (via drill 0.35)
  Signal1 0.127: U3.25 6.49,11.03 6.49,11.34 7.28,12.14 7.42,12.14 7.68,12.39 8.29,12.39 v8.66,12.77 | TP3.P$1 8.02,2.39 8.02,3.28 7.63,3.67 R1.1 7.4,3.81 6.76,4.45 5.91,4.45 5.27,3.81 R2.1 v5.1,3.75
  Signal1 0.203: R2.1 4.92,3.94 4.24,4.62 3.35,4.62 3.22,4.48 3.22,4.47 C1.1
  GND 0.127: v10.03,14.78 8.66,13.41 v8.66,12.77
  VCC 0.127: v10.03,14.78 10.03,13.09 10.62,12.51 10.62,10.5 5.1,4.98 v5.1,3.75
RXD  (via drill 0.35)
  Signal1 0.127: U3.26 5.9,11.88 4.32,13.46 v4.04,13.46 | TP8.P$1 v1.01,11.56
  VCC 0.127: v1.01,11.56 1.95,10.62 1.95,10.48 2.22,10.2 2.61,10.2 2.88,10.48 2.88,12.31 v4.04,13.46
SCLK
  Signal1 0.127: U3.15 11.51,7.54 12.19,6.86 TP2.P$1
THERMIN  (via drill 0.35)
  Signal1 0.127: U3.19 8.89,9.34 9.63,10.08 10.2,10.08 10.98,10.86 11.85,10.86 v12.07,11.08 | J6.8 22.35,5.14 v22.35,5.05
  Signal1 0.508: J6.8 21.21,5.01 R23.1
  GND 0.127: v20.7,1.91 22.35,3.56 v22.35,5.05
  VCC 0.127: v12.07,11.08 11.56,10.57 11.37,10.57 9.6,8.79 9.6,3.32 9.87,3.05 10.26,3.05 19.56,3.05 v20.7,1.91
TXD  (via drill 0.35)
  Signal1 0.127: U3.27 5.45,11.82 4.49,12.78 v4.06,12.78 | TP9.P$1 v0.55,10.16
  VCC 0.127: v4.06,12.78 3.13,11.85 3.13,10.37 2.71,9.95 2.11,9.95 1.9,10.16 v0.55,10.16
VCC  (via drill 0.3, 0.35)
  Signal1 0.254: v23.62,10.03 22.87,10.78 22.87,11.05 22.51,11.41 22.08,11.41
  Signal1 0.406: U2.3 16.13,4.19 15.88,4.19 19.33,7.64 J6.6 23.01,7.64 23.11,7.75 23.11,8.41 23.61,8.91 23.61,10.42 22.76,11.27 22.21,11.27 22.08,11.41 J6.2
  Signal1 0.66: J1.VIN0 20.76,21.84 21.04,22.12 23.41,22.12 23.68,21.85 23.68,20.57 23.52,20.41 U1.3 | U1.1 23.52,17.69 23.68,17.53 23.68,15.43 v22.99,14.73
  Signal1 0.762: J1.VIN0 16.39,21.84 C4.1
  GND 0.254: v22.99,14.73 22.99,13.56 24.78,11.77 24.78,11.35 23.62,10.19 v23.62,10.03
  Signal2 0.127: U$2.6 19.43,7.21 19.19,6.97 19.19,3.95 19.05,3.81 | U$3.6 18.93,17.93 19.17,18.18 19.17,21.33 19.05,21.45 19.05,21.59 | U$1.6 5.97,17.81 6.21,18.05 6.21,21.33 6.1,21.44 5.61,21.44 v5.4,21.65 | U$4.6 6.47,7.47 6.23,7.23 6.23,2.45 6.01,2.23 6.01,2.16 v5.46,1.61
  Signal2 0.254: 19.05,3.81 v19.05,3.77
  Signal2 0.508: 19.05,21.59 18.8,21.84 J1.VIN0
  other vias: 16.51,3.81 18.4,21.84 14.1,24.13
  pour VCC (no thermals): -0.13,25.53 -0.13,0 25.4,0 25.4,25.53
  pour Signal1 (rank 2, no thermals): 25.4,25.53 25.4,0 -0.13,0 -0.13,25.53
  pour Signal2 (no thermals): 25.4,25.53 25.4,0 -0.13,0 -0.13,25.53
XDIR  (via drill 0.35)
  Signal1 0.127: U3.22 8.77,10.89 v8.91,10.74
  VCC 0.127: v3.05,22.21 3.07,22.21 3.55,22.69 4.6,22.69 4.88,22.42 4.88,22.02 3.3,20.45 3.3,17.11 5.66,17.11 10.37,12.4 10.37,10.61 10.09,10.33 9.7,10.33 9.3,10.74 v8.91,10.74
  Signal2 0.127: U$1.1 4.55,14.29 4.25,14.29 2.18,16.36 2.18,21.33 3.05,22.19 v3.05,22.21
XENABLE  (via drill 0.35)
  Signal1 0.127: U3.21 9.07,10.24 9.42,10.59 9.69,10.59 v9.9,10.8
  VCC 0.127: v9.9,10.8 9.9,12.51 8.37,14.04 7.98,14.04 7.51,13.58 v7.49,13.58
  Signal2 0.127: U$1.13 7.28,13.36 v7.49,13.58
XEND  (via drill 0.35)
  Signal1 0.127: U3.20 8.98,9.79 9.53,10.33 10.09,10.33 10.87,11.12 11.3,11.12 v11.94,11.76 | J7.6 3.81,16.34 4.16,16.34 5.32,17.5 5.32,20.96 4.41,21.87 v4.41,22.23
  GND 0.127: v14.62,18.18 12.3,20.51 12.15,20.51 10.43,22.23 v4.41,22.23
  VCC 0.127: v14.62,18.18 14.03,17.59 14.03,16.72 12.13,14.82 12.13,12.71 11.94,12.52 v11.94,11.76
XSTEP  (via drill 0.35)
  Signal1 0.127: U3.23 7.39,11.03 7.39,11.34 7.54,11.49 7.86,11.49 8,11.36 8.95,11.36 v9.01,11.42
  VCC 0.127: v3.05,21.53 3.05,15.75 4.75,14.04 5.06,14.04 7.68,11.42 v9.01,11.42
  Signal2 0.127: U$1.2 4.55,14.79 4.14,14.79 2.44,16.5 2.44,19.77 3.05,20.38 v3.05,21.53
YDIR  (via drill 0.35)
  Signal1 0.127: U3.28 5,11.61 v4.43,12.18
  VCC 0.127: 4.11,11.39 4.32,11.6 4.32,12.08 v4.43,12.18 4.43,10.95 2.92,9.44 2.84,9.44 2.79,9.4 2.79,3.86 3.75,2.9 3.75,1.96 4.95,0.76 9.88,0.76 10.6,1.48 12.35,1.48 13.08,0.76 20.95,0.76 21.72,1.52 21.72,10.8 v20.57,11.94
  Signal2 0.127: U$2.1 20.67,11.84 v20.57,11.94
YENABLE  (via drill 0.35)
  Signal1 0.127: U3.24 6.94,11.03 6.94,11.34 7.48,11.88 8.51,11.88 v8.72,12.09
  GND 0.127: v18.03,12.45 15.7,14.79 15.7,16.91 15.37,17.23 14.98,17.23 12.75,15 11.62,15 v8.72,12.09
  Signal2 0.127: U$2.13 18.03,12.43 v18.03,12.45
YEND  (via drill 0.35)
  Signal1 0.127: U3.13 7.39,6.75 7.39,6.44 7.54,6.29 7.86,6.29 8.18,6.6 11.56,6.6 11.68,6.48 11.68,3.81 11.11,3.24 10.45,3.24 9.63,2.41 TP5.P$1 v9.4,2.55 | v3.73,22.21 3.73,22.19 5.06,20.86 5.06,18.23 4.8,17.97 3.45,17.97 J7.4
  GND 0.127: v9.4,2.55 8.2,2.55 7.58,3.17 4.45,3.17 1.02,6.61 1.02,10.35 0.74,10.63 0.51,10.63 0.51,20.87 2.32,22.68 3.26,22.68 v3.73,22.21
YSTEP  (via drill 0.35)
  Signal1 0.127: U3.1 4.69,10.58 4.69,10.96 v3.85,11.8
  VCC 0.127: v23.01,9.16 23.01,2.65 22.47,2.11 22.47,1 21.97,0.51 4.83,0.51 3.1,2.24 3.09,2.24 2.54,2.79 2.54,9.52 2.71,9.69 2.82,9.69 3.39,10.26 3.39,11.33 v3.85,11.8
  Signal2 0.127: U$2.2 21.38,10.79 v23.01,9.16
ZDIR  (via drill 0.35)
  Signal1 0.127: U3.11 6.49,6.75 6.49,6.44 7.14,5.78 8.07,5.78 8.39,6.1 10.35,6.1 10.78,5.67 10.82,5.67 v11.03,5.46
  GND 0.127: v11.03,5.46 12.95,5.46 13.97,6.48 13.97,7.47 15.44,8.94 15.44,15.78 v15.14,16.08
  Signal2 0.127: U$3.1 17.5,14.29 17.21,14.29 15.41,16.08 v15.14,16.08
ZENABLE  (via drill 0.35)
  Signal1 0.127: U3.10 6.04,6.75 6.04,6.44 6.95,5.53 8.18,5.53 8.49,5.84 9.98,5.84 10.83,4.99 10.87,4.99 v11.09,4.78
  VCC 0.127: v11.09,4.78 13.87,7.56 13.87,14.29 14.14,14.56 14.56,14.56 15.55,13.58 v20.57,13.58
  Signal2 0.127: U$3.13 20.36,13.36 v20.57,13.58
ZEND  (via drill 0.35)
  Signal1 0.127: U3.14 11.78,6.89 11.94,6.73 11.94,3.43 10.92,2.41 TP1.P$1 | v3.73,21.53 3.94,21.32 4.16,21.32 4.27,21.21 4.27,20.45 4.16,20.34 3.81,20.34 J7.2
  GND 0.127: TP1.P$1 10.16,3.05 8.36,3.05 1.48,9.93 1.48,11.75 1.2,12.02 0.93,12.02 0.76,12.19 0.76,20.7 1.13,21.07 3.24,21.07 3.71,21.53 v3.73,21.53
  other vias: 10.8,2.41
ZSTEP  (via drill 0.35)
  Signal1 0.127: U3.12 6.94,6.75 6.94,6.44 7.34,6.04 7.97,6.04 8.28,6.35 10.76,6.35 v10.97,6.14
  GND 0.127: v10.97,6.14 13.25,6.14 13.72,6.6 13.72,7.58 15.13,9 15.13,15.43 14.67,15.89 14.67,16.28 14.95,16.55 14.97,16.55 v15.18,16.76
  Signal2 0.127: v15.18,16.76 15.39,16.55 15.39,16.5 17.28,14.61 U$3.2

### Text on the board
bPlace: Return of the Square Inch Project | Design: Walker Arce
tDocu: 1/32nd Microstepping Mode | RST PTH
_tsilk: 11V MAX | MIC5205 | GND | RX | TX | 5V | MJD122 | MOSI | MISO | SCLK | RST | GND | 5V